# EAGLE design sensortag_motherboard_v004 (EAGLE 7.7.0)
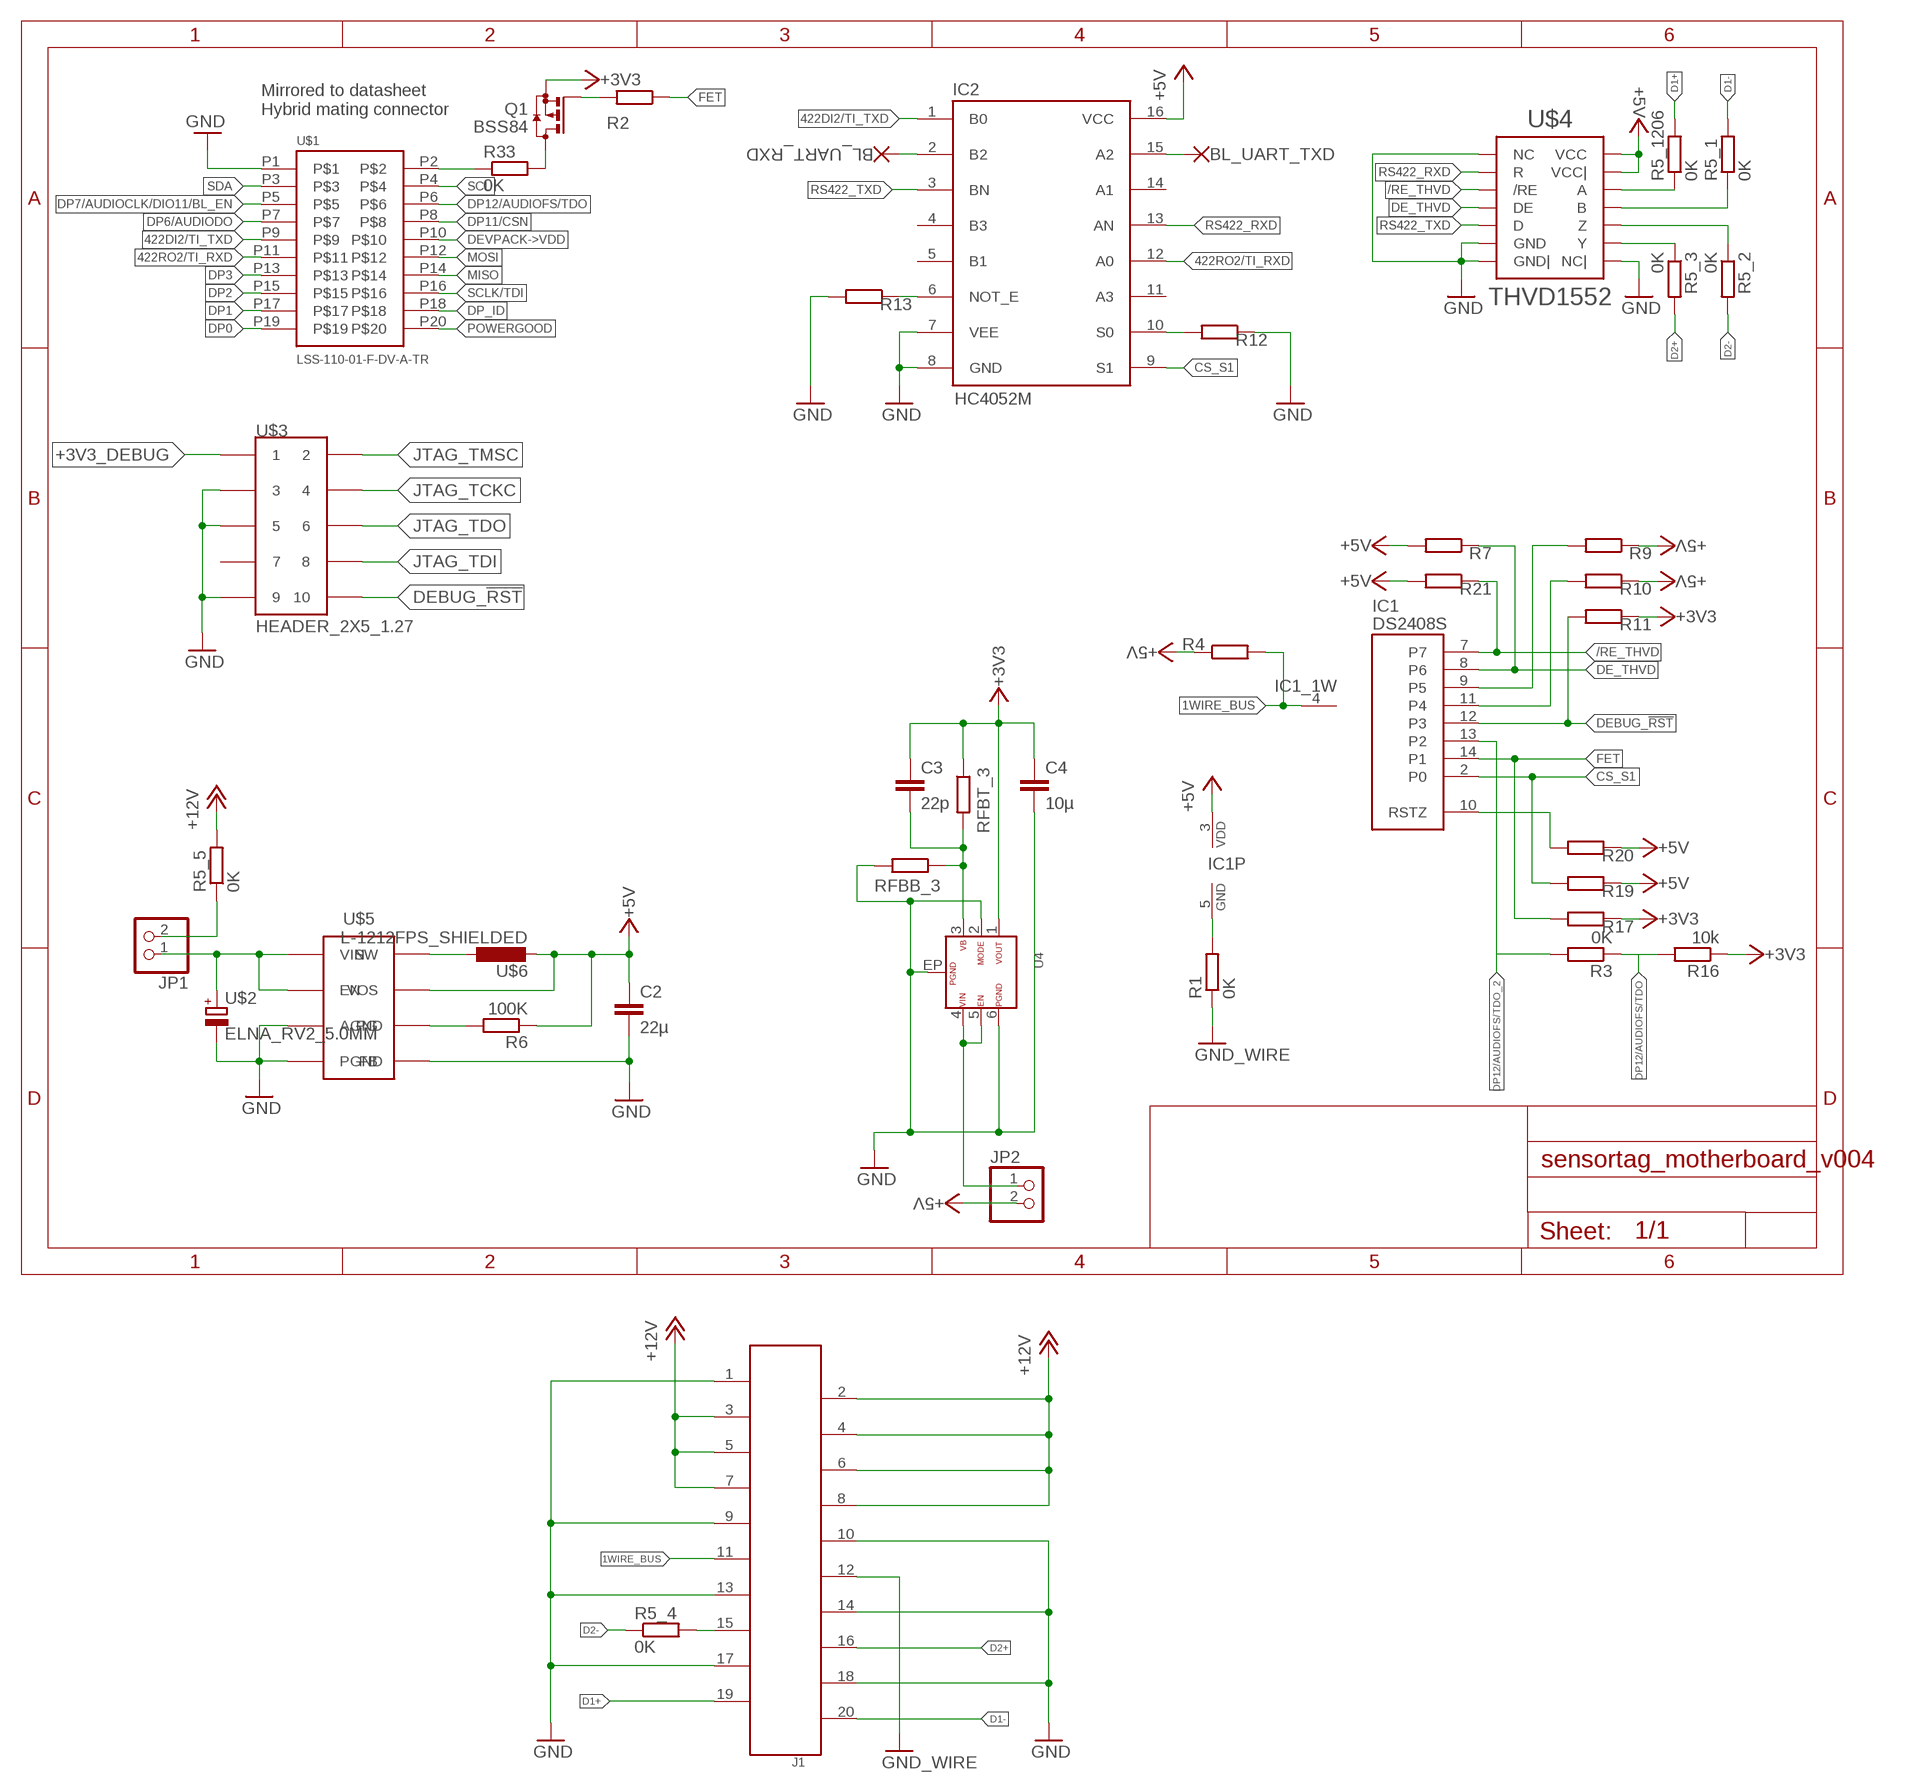
[diagram p0: schematic, sheet 1]

## Parts
BL_UART_RXD  WIREPADSMD1,27-254  [SMD1,27-2,54]
BL_UART_TXD  WIREPADSMD1,27-254  [SMD1,27-2,54]
C2  22µ  C-EUC1206  [C1206]
C3  22p  C-EUC0402  [C0402]
C4  10µ  C-EUC0603  [C0603]
IC1  DS2408S  [SO16]
IC2  HC4052M  [SO16]
J1  490107672012  [490107672012]
JP1  PINHD-1X2  [1X02]
JP2  PINHD-1X2  [1X02]
Q1  BSS84  [SOT23]
R1  0K  R-EU_R0603  [R0603]
R2  100  R0402  [R0402]
R3  0K  R-EU_R0603  [R0603]
R4  10k  R0402  [R0402]
R5_1  0K  R-EU_R1206  [R1206]
R5_2  0K  R-EU_R1206  [R1206]
R5_3  0K  R-EU_R1206  [R1206]
R5_4  0K  R-EU_R1206  [R1206]
R5_5  0K  R-EU_R1206  [R1206]
R5_1206  0K  R-EU_R1206  [R1206]
R6  100K  R-EU_R0603  [R0603]
R7  10k  R0402  [R0402]
R9  10k  R0402  [R0402]
R10  10k  R0402  [R0402]
R11  10k  R0402  [R0402]
R12  10k  R0402  [R0402]
R13  10k  R0402  [R0402]
R16  10k  R0402  [R0402]
R17  10k  R0402  [R0402]
R19  10k  R0402  [R0402]
R20  10k  R0402  [R0402]
R21  10k  R0402  [R0402]
R33  0K  R-EU_R0603  [R0603]
RFBB_3  22,1K  R0402  [R0402]
RFBT_3  100K  R0402  [R0402]
U4  VDMM_171960501  [VDMM_171960501]
U$1  LSS-110-01-F-DV-A-TR  [LSS-110-01-F-DV-A-TR]
U$2  ELNA_RV2_5.0MM  [ELNA_RV2_5.0MM]
U$3  HEADER_2X5_1.27  [HEADER_2X5_1.27]
U$4  TVHD1552  [SO14]
U$5  TPS62173  [WSON8]
U$6  L-1212FPS_SHIELDED  [L-1212FPS_SHIELDED]

## Nets
1WIRE_BUS: IC1.4(1W) J1.11 R4.P$2
422DI2/TI_TXD: IC2.1(B0) U$1.P9
422RO2/TI_RXD: IC2.12(A0) U$1.P11
+3V3: C3.1 C4.1 Q1.2(S) R11.P$1 R16.P$1 R17.P$1 RFBT_3.P$1 U4.1(VOUT)
+3V3_DEBUG: U$3.P$1
+5V: C2.1 IC1.3(VDD) IC2.16(VCC) JP2.2 R4.P$1 R6.1 R7.P$2 R9.P$1 R10.P$1 R19.P$1 R20.P$1 R21.P$2 U$4.13(VCC|) U$4.14(VCC) U$5.VOS U$6.P$2
+5V_JP: JP2.1 U4.4(VIN) U4.5(EN)
+12V: J1.2 J1.3 J1.4 J1.5 J1.6 J1.7 J1.8 R5_5.2
+12V_JP: JP1.1 U$2.P+(+) U$5.EN U$5.VIN
/RE_THVD: IC1.7 R21.P$1 U$4.3(/RE)
BL_UART_RXD: BL_UART_RXD.1(P) IC2.2(B2)
BL_UART_TXD: BL_UART_TXD.1(P) IC2.15(A2)
CS_S1: IC1.2(P0) IC2.9(S1) R19.P$2
D1+: J1.19 R5_1206.2
D1-: J1.20 R5_1.2
D2+: J1.16 R5_3.2
D2-: R5_2.2 R5_4.1
DE_THVD: IC1.8(P6) R7.P$1 U$4.4(DE)
DEBUG_!RST: IC1.12(P3) R11.P$2 U$3.P$10
DEVPACK->VDD: U$1.P10
DP0: U$1.P19
DP1: U$1.P17
DP2: U$1.P15
DP3: U$1.P13
DP6/AUDIODO: U$1.P7
DP7/AUDIOCLK/DIO11/BL_EN: U$1.P5
DP11/CSN: U$1.P8
DP12/AUDIOFS/TDO: R3.1 R16.P$2 U$1.P6
DP12/AUDIOFS/TDO_2: IC1.13(P2) R3.2
DP_ID: U$1.P18
DS4: IC1.11(P4) R10.P$2
DS5: IC1.9(P5) R9.P$2
DS_RESET: IC1.10(RSTZ) R20.P$2
FET: IC1.14(P1) R2.P$1 R17.P$2
GND: C2.2 C4.2 IC2.7(VEE) IC2.8(GND) J1.1 J1.9 J1.10 J1.13 J1.14 J1.17 J1.18 R12.P$1 R13.P$2 RFBB_3.P$2 U4.2(MODE) U4.6(PGND) U4.EP(PGND1) U$1.P1 U$2.P-(-) U$3.P$3 U$3.P$5 U$3.P$9 U$4.1(NC) U$4.6(GND) U$4.7(GND|) U$4.8(NC|) U$5.AGND U$5.AGND2(AGND) U$5.FB U$5.PGND
GND_WIRE: J1.12 R1.1
JTAG_TCKC: U$3.P$4
JTAG_TDI: U$3.P$8
JTAG_TDO: U$3.P$6
JTAG_TMSC: U$3.P$2
MISO: U$1.P14
MOSI: U$1.P12
N$2: R33.1 U$1.P2
N$3: Q1.3(D) R33.2
N$4: Q1.1(G) R2.P$2
N$5: R6.2 U$5.PG
N$6: C3.2 RFBB_3.P$1 RFBT_3.P$2 U4.3(FB)
N$7: R5_1206.1 U$4.12(A)
N$8: R5_1.1 U$4.11(B)
N$9: R5_2.1 U$4.10(Z)
N$10: R5_3.1 U$4.9(Y)
N$11: IC1.5(GND) R1.2
N$12: U$5.SW U$6.P$1
N$13: J1.15 R5_4.2
N$14: JP1.2 R5_5.1
N$22: IC2.10(S0) R12.P$2
POWERGOOD: U$1.P20
PULLDOWN_???: IC2.6(NOT_E) R13.P$1
RS422_RXD: IC2.13(AN) U$4.2(R)
RS422_TXD: IC2.3(BN) U$4.5(D)
SCL: U$1.P4
SCLK/TDI: U$1.P16
SDA: U$1.P3
Unconnected: IC2.4(B3) IC2.5(B1) IC2.11(A3) IC2.14(A1) U$3.P$7

## Notes on the sheet
- Mirrored to datasheet
  Hybrid mating connector

## Library data of the parts
BL_UART_RXD BL_UART_TXD = wirepad:WIREPAD: Wire PAD connect wire on PCB
C2-C4 = rcl:C-EU: CAPACITOR, European symbol
IC1 = 1wire:DS2408: 8-Channel Addressable Switch This is a general purpose I/O multiplier. The PIO pins P0..P7 are inputs/open drain outputs and can be used in a mixed I/O fashion. Output sink capability is appr. 4mA. Each input state can be read but changing input signals additionally trigger the egde detector for this input. The edge detector state can be read back, too. The RSTZ pin can be configured by software as a –STROBE output (default) or as the common edge detector –RESET input. In the latter mode, the output pins are all set to floating on a –RESET trigger, too. Author: Jan Kandziora <jjj@gmx.de>
IC2 = 40xx:HC4052M
J1 = customLibs:490107672012: REDFIT IDC SKEDD Connector WR-WST PROPERTIES: Insulator Material LCP Insulator Flammability Rating UL94 V-0 Insulator Color Black Contact Material CuNiSi Contact Plating Au (SKEDD), Sn (IDC) Cable AWG 28/1.27 mm ribbon cable Operating Temperature -25 °C up to +105 °C Compliance Lead free / RoHS Mating Cycle 10 Mating Cycle 25 PCB Thickness 1.6 mm ELECTRICAL PROPERTIES: Rated Current [1] 1 A Insulation Resistance 1000 MΩ Withstanding Voltage 500 V (AC) Contact Resistance 10 mΩ PACKAGING PROPERTIES: Packaging Tube <http://katalog.we-online.de/media/images/v2/Family_WR-WST_69010767xxxx.jpg> http://katalog.we-online.de/en/em/REDFIT_IDC_SKEDD Created 2017-11-16, Yingchun,Shan 2017 (C) Würth Elektronik
JP1 JP2 = pinhead:PINHD-1X2: PIN HEADER
Q1 = transistor-small-signal:BSS84: P-CHANNEL MOS FET
R1 R3 R5_1-R5_5 R5_1206 R6 R33 = rcl:R-EU_: RESISTOR, European symbol
R2 R4 R7 R9-R13 R16 R17 R19-R21 RFBB_3 RFBT_3 = iml_rcl:R0402
U4 = Eagle_STEP-DOWN-CONVERTER (rev18c):VDMM_171960501: MagI³C-VDMM Variable Step Down MicroModule Characteristics LGA <http://katalog.we-online.de/media/images/v2/LGA-6_MicroModule_171960501.jpg> Details see: http://katalog.we-online.de/pm/datasheet/171960501.pdf Created By Yingchun,Shan 2017-12-15 2017 (C) Wurth Elektronik
U$1 = customLibs:LSS-110-01-F-DV-A-TR
U$2 = customLibs:ELNA_RV2_5.0MM
U$3 = David_Spezial:HEADER_2X5_1.27
U$4 = moekoe:TVHD1552
U$5 = customLibs:TPS62173
U$6 = customLibs:L-1212FPS_SHIELDED

## Board
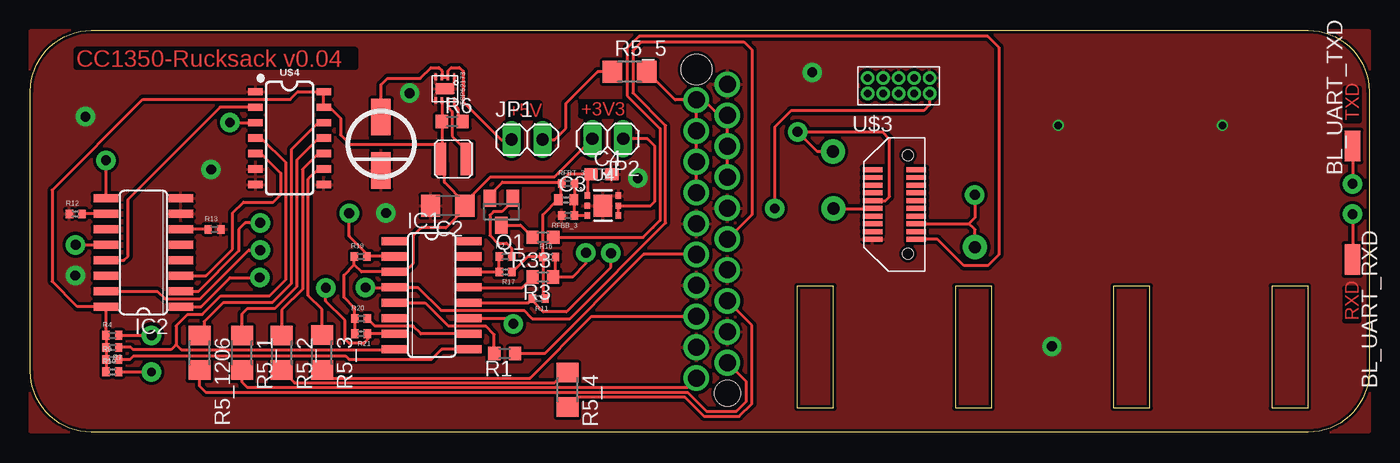
[diagram p1: board, top side]
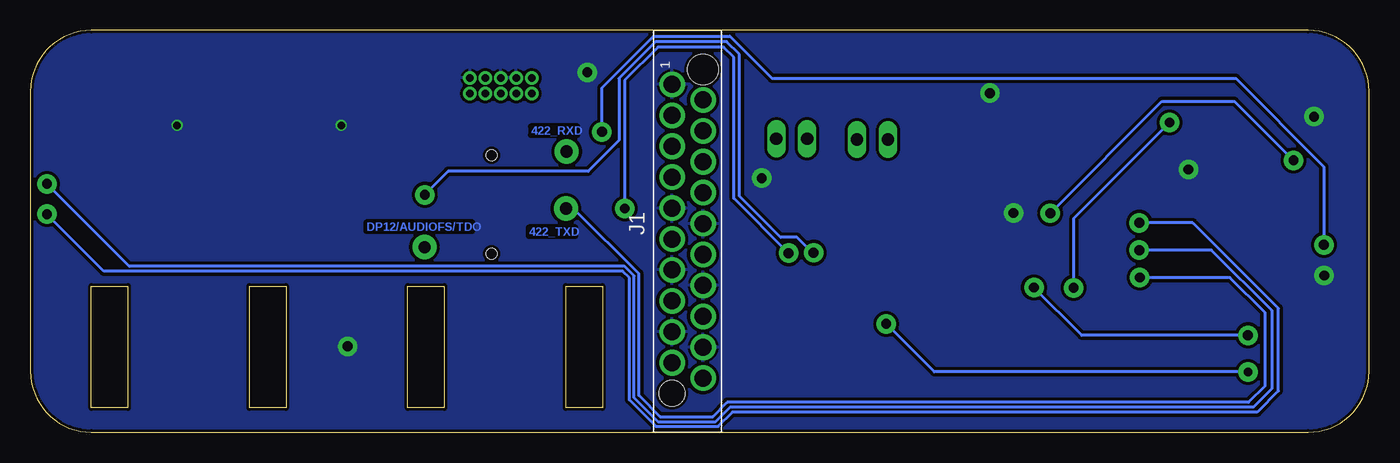
[diagram p2: board, bottom side, seen from below]

Size 110 x 33 mm. Coordinates in mm from the lower left corner, seen from the top.
Outline: 105,0 5,0 arc-90 0,5 0,28 arc-90 5,33 105,33 arc-90 110,28 110,5 arc-90 105,0
Outline: 63,12 63,2 66,2 66,12 63,12
Outline: 102,12 102,2 105,2 105,12 102,12
Outline: 76,12 76,2 79,2 79,12 76,12
Outline: 89,12 89,2 92,2 92,12 89,12
Copper layers (1*16): Top 0.018mm / dielectric 1.55mm / Bottom 0.018mm
Design rules "Multi-CB_2L_125um-Tracks_OL35um *": minimum track width 0.125mm, minimum drill 0.2mm, track to track 0.125mm, track to pad 0.125mm, pad to pad 0.125mm, via to via 0.125mm, smd to smd 0mil, copper to edge 0.2mm, drill to drill 0.2mm, minimum pad ring 0.125mm, minimum via ring 0.125mm, stop-mask expansion 2mil, vias tented up to drill 0.45mm, thermal gap 0.2mm

### Footprints (pad centres in the part's own frame; a part is rotated, then mirrored left to right if it is on the bottom)
SMD1,27-2,54 = smd 1.27 x 2.54: 1 0,0
C1206 = smd 1.6 x 1.8: 1 -1.4,0; 2 1.4,0
C0402 = smd 0.7 x 0.9: 1 -0.65,0; 2 0.65,0
C0603 = smd 1.1 x 1: 1 -0.85,0; 2 0.85,0
SO16 = smd 0.66 x 2.032: 1 -4.445,-3.073; 2 -3.175,-3.073; 3 -1.905,-3.073; 4 -0.635,-3.073; 5 0.635,-3.073; 6 1.905,-3.073; 7 3.175,-3.073; 8 4.445,-3.073; 9 4.445,3.073; 10 3.175,3.073; 11 1.905,3.073; 12 0.635,3.073; 13 -0.635,3.073; 14 -1.905,3.073; 15 -3.175,3.073; 16 -4.445,3.073
490107672012 = drill 1.4 pad 1.42: 1 12.065,1.27; 2 10.795,-1.27; 3 9.525,1.27; 4 8.255,-1.27; 5 6.985,1.27; 6 5.715,-1.27; 7 4.445,1.27; 8 3.175,-1.27; 9 1.905,1.27; 10 0.635,-1.27; 11 -0.635,1.27; 12 -1.905,-1.27; 13 -3.175,1.27; 14 -4.445,-1.27; 15 -5.715,1.27; 16 -6.985,-1.27; 17 -8.255,1.27; 18 -9.525,-1.27; 19 -10.795,1.27; 20 -12.065,-1.27 | hole 2.1: -13.295,1.27 | hole 2.5: 13.295,-1.27
1X02 = drill 1.016 long: 1 -1.27,0; 2 1.27,0
SOT23 = smd 1 x 1.4: 1 -0.95,-1.1; 2 0.95,-1.1; 3 0,1.1
R0603 = smd 1 x 1.1: 1 -0.85,0; 2 0.85,0
R0402 = smd 0.61 x 0.711: P$1 -0.52,0; P$2 0.52,0
R1206 = smd 1.6 x 1.803: 1 -1.422,0; 2 1.422,0
VDMM_171960501 = smd 0.45 x 0.55: 1 -1.275,0.825; 3 -1.275,-0.825; 4 1.275,-0.825; 6 1.275,0.825 | smd 0.45 x 0.5: 2 -1.275,0; 5 1.275,0 | smd 1.5 x 1.8: EP 0,0
LSS-110-01-F-DV-A-TR = smd 0.4 x 1.6: P1 2.857,-1.8; P2 2.857,1.8; P3 2.223,-1.8; P4 2.223,1.8; P5 1.587,-1.8; P6 1.587,1.8; P7 0.953,-1.8; P8 0.953,1.8; P9 0.318,-1.8; P10 0.318,1.8; P11 -0.318,-1.8; P12 -0.318,1.8; P13 -0.953,-1.8; P14 -0.953,1.8; P15 -1.587,-1.8; P16 -1.587,1.8; P17 -2.223,-1.8; P18 -2.223,1.8; P19 -2.857,-1.8; P20 -2.857,1.8 | hole 0.89: 4.04,1.1; -4.04,1.1
ELNA_RV2_5.0MM = smd 1.6 x 3: P+ 0,2.2; P- 0,-2.2
HEADER_2X5_1.27 = drill 0.6 pad 1.1: P$1 -2.54,0.635; P$2 -2.54,-0.635; P$3 -1.27,0.635; P$4 -1.27,-0.635; P$5 0,0.635; P$6 0,-0.635; P$7 1.27,0.635; P$8 1.27,-0.635; P$9 2.54,0.635; P$10 2.54,-0.635
SO14 = smd 0.6 x 1.2: 1 -3.175,-2.8; 2 -1.905,-2.8; 3 -0.635,-2.8; 4 0.635,-2.8; 5 1.905,-2.8; 6 3.175,-2.8; 7 4.445,-2.8; 8 4.445,2.8; 9 3.175,2.8; 10 1.905,2.8; 11 0.635,2.8; 12 -0.635,2.8; 13 -1.905,2.8; 14 -3.175,2.8
WSON8 = smd 0.5 x 0.25: AGND -0.95,-0.75; EN -0.95,-0.25; FB 0.95,-0.75; PG 0.95,0.75; PGND -0.95,0.75; SW 0.95,0.25; VIN -0.95,0.25; VOS 0.95,-0.25 | smd 0.9 x 1.6: AGND2 0,0
L-1212FPS_SHIELDED = smd 1 x 2.7: P$1 1.1,0; P$2 -1.1,0

### Placement (x,y rotation side)
BL_UART_RXD  108.63,14.19 180 top
BL_UART_TXD  108.64,23.51 0 top
C2  34.28,18.59 180 top
C3  44.02,19.08 0 top
C4  46.92,21.19 0 top
IC1  32.97,11.26 270 top
IC2  9.29,14.76 90 top
J1  56,16.5 90 bottom
JP1  40.81,24.03 0 top
JP2  47.44,24.1 180 top
Q1  38.69,18.11 180 top
R1  38.96,6.46 180 top
R2  39.03,14.42 0 top
R3  42.11,12.74 180 top
R4  6.73,7.96 0 top
R5_1  17.39,6.52 270 top
R5_2  20.66,6.52 270 top
R5_3  23.95,6.54 270 top
R5_4  44.14,3.47 270 top
R5_5  49.24,29.6 0 top
R5_1206  13.9,6.52 270 top
R6  34.66,25.52 0 top
R7  6.73,6.96 180 top
R9  6.73,5.96 0 top
R10  6.73,4.96 0 top
R11  41.77,10.97 180 top
R12  3.71,17.93 0 top
R13  15.13,16.66 0 top
R16  42.63,14.4 0 top
R17  39.04,13.16 180 top
R19  27.14,14.44 0 top
R20  27.18,9.33 0 top
R21  27.17,8.08 180 top
R33  42.12,16.01 180 top
RFBB_3  44.18,17.79 180 top
RFBT_3  44.17,20.43 0 top
U4  47.04,18.61 0 top
U$1  71,18.7 270 top
U$2  28.81,23.68 0 top
U$3  71.35,28.46 0 top
U$4  21.3,24.79 270 top
U$5  34.06,28.21 270 top
U$6  34.76,22.43 0 top

### Tracks (layer width: path | path; a pad name or v marks a point on that pad's centre or on a via)
1WIRE_BUS  (via drill 0.8 pad 1.6)
  Top 0.254: R4.P$2 v9.96,7.96 | v27.54,11.88 IC1.4 31.83,11.89 33.73,9.99 40.56,9.99 41.22,9.33 44.33,9.33 52.19,17.19 52.19,25.17 49.5,27.87 49.5,31.34 50.22,32.06 58.63,32.06 59.27,31.42 59.27,17.87 J1.11
  Bottom 0.254: v9.96,7.96 23.62,7.96 v27.54,11.88
422DI2/TI_TXD  (via drill 0.8 pad 1.6, 1 pad 2)
  Top 0.254: IC2.1 14.02,10.31 16.41,12.7 v18.84,12.7 | v65.99,18.37 U$1.P9
  Bottom 0.254: v18.84,12.7 11.42,12.7 8.56,9.83 8.56,3.78 9.9,2.44 52.75,2.44 53.91,1.28 58.26,1.28 60,3.02 60,13 65.37,18.37 v65.99,18.37
422RO2/TI_RXD  (via drill 0.8 pad 1.6, 1 pad 2)
  Top 0.254: v3.71,15.39 IC2.12 | U$1.P11 70.27,19.02 70.6,19.34 70.6,24.07 70,24.67 v63.03,24.67 64.64,23.06 v65.94,23.06
  Bottom 0.254: v3.71,15.39 v3.71,15.4 3.71,21.8 10.97,29.06 49.06,29.06 52.53,32.53 58.78,32.53 63.03,28.28 v63.03,24.67
+3V3
  Top 0.254: R17.P$1 39.57,13.14 39.57,13.15 | 37.83,19.21 Q1.2 | 39.69,13.16 R17.P$1 | R16.P$1 40.84,14.4 39.6,13.16 R17.P$1 | R16.P$1 42.11,11.15 R11.P$1 | 37.74,19.32 Q1.2 | 37.46,19.5 Q1.2 | Q1.2 37.74,19.48 38.8,20.53 43.55,20.53 RFBT_3.P$1 | U4.1 45.76,20.88 C4.1 44.2,21.19 43.66,20.64 RFBT_3.P$1 | R16.P$1 42.11,17.88 43.32,19.08 C3.1 43.59,19.31 43.59,20.37 RFBT_3.P$1 | RFBT_3.P$1 43.61,20.43
+5V
  Top 0.254: R10.P$1 R9.P$1 R7.P$2 R4.P$1 IC2.16 3.87,10.31 1.78,12.4 1.78,19.89 9.23,27.34 21.35,27.34 21.97,27.96 U$4.14 U$4.13 24.57,26.69 25.48,25.79 25.48,24.43 26.25,23.66 33.28,23.66 33.28,23.54 33.81,23 | R21.P$2 R20.P$1 26.66,10.19 25.78,11.07 25.78,12.9 26.62,13.74 | 26.62,13.74 27.2,13.16 IC1.3 30.74,13.16 31.48,13.9 31.48,16.16 32.1,16.79 34.14,16.79 35.68,18.33 C2.1 35.68,18.85 | 26.62,13.74 R19.P$1 | JP2.2 43.03,20.96 37.79,20.96 35.68,18.85 | 35.68,18.85 35.68,18.86 | U$5.VOS R6.1 33.81,23 | 33.81,23 33.81,22.59 U$6.P$2 34.03,22.06 34.03,20.52 35.68,18.86 | 35.68,18.86
+5V_JP
  Top 0.254: U4.4 U4.5 50.96,18.61 51.32,18.97 51.32,23.49 50.71,24.1 JP2.1
+12V
  Top 0.254: J1.8 J1.6 J1.4 J1.2 | J1.7 J1.5 J1.3 56.57,26.02 55.3,27.3 J1.2 | J1.2 52.97,27.3 R5_5.2
+12V_JP
  Top 0.254: JP1.1 38.66,24.03 35.56,27.13 35.56,29.65 35.26,29.95 34.57,29.95 34.31,29.69 U$5.VIN U$5.EN 33.81,29.69 33.56,29.94 32.91,29.94 32.04,29.07 29.34,29.07 28.81,28.54 U$2.P+
/RE_THVD  (via drill 0.8 pad 1.6)
  Top 0.254: IC1.7 R21.P$1 | R21.P$1 | R21.P$1 27.7,7.62 27.36,7.29 26.2,7.29 25.86,7.63 25.86,9.17 24.27,10.76 v24.27,11.86 | v16.39,25.43 U$4.3
  Bottom 0.254: v16.39,25.43 24.27,17.55 v24.27,11.86
BL_UART_RXD  (via drill 0.8 pad 1.6)
  Top 0.254: IC2.2 13.83,11.58 17.13,14.88 17.13,16.67 17.66,17.2 v18.88,17.2 | v108.65,17.91 108.65,14.2 BL_UART_RXD.1
  Bottom 0.254: v108.65,17.91 103.96,13.22 61.33,13.22 60.79,12.68 60.79,2.66 58.6,0.48 53.49,0.48 52.32,1.65 9.19,1.65 7.46,3.39 7.46,10.16 14.49,17.2 v18.88,17.2
BL_UART_TXD  (via drill 0.8 pad 1.6)
  Top 0.254: IC2.15 10.43,11.57 11.06,10.94 13.94,10.94 17.95,14.95 v18.88,14.95 | BL_UART_TXD.1 v108.64,20.4 v108.65,20.4
  Top 0.406: IC2.15
  Bottom 0.254: v108.65,20.4 101.88,13.63 61.17,13.63 60.39,12.84 60.39,2.83 58.43,0.87 53.69,0.87 52.5,2.06 9.5,2.06 8,3.56 8,10 12.95,14.95 v18.88,14.95
CS_S1  (via drill 0.8 pad 1.6)
  Top 0.254: IC1.2 29.88,14.44 R19.P$2 27.64,14.46 27.64,14.67 26.2,16.11 v26.2,17.98 | IC2.9 v6.22,22.33
  Bottom 0.254: v6.22,22.33 11.05,27.16 17.02,27.16 v26.2,17.98
D1+
  Top 0.254: R5_1206.2 13.9,3.77 14.4,3.27 54,3.27 55.54,1.73 58.01,1.73 58.82,2.54 58.82,4.15 J1.19
D1-
  Top 0.254: R5_1.2 17.39,4.11 17.83,3.66 53.95,3.66 J1.20
D2+
  Top 0.254: R5_3.2 24.63,4.45 41.04,4.45 46.11,9.52 J1.16
D2-
  Top 0.254: R5_2.2 21.7,4.05 43.05,4.05 44,5 44.03,5 R5_4.1
DE_THVD
  Top 0.254: 29.75,6.96 IC1.8 29.86,6.77 12.39,6.77 11.98,7.19 | U$4.4 18.97,24.15 21,22.13 21,12.55 19.65,11.2 15.64,11.2 14.13,9.68 12.92,9.68 11.98,8.74 11.98,7.19 | R7.P$1 8.24,6.96 8.43,6.77 11.56,6.77 11.98,7.19
DEBUG_!RST  (via drill 0.8 pad 1.6)
  Top 0.254: v47.7,14.7 47.7,13.55 44.04,9.89 42.14,9.89 41.25,10.78 R11.P$2 40.9,10.62 IC1.12 | U$3.P$10 73.89,26.89 73.41,26.41 62.5,26.41 61.17,25.08 v61.17,18.37
  Bottom 0.254: v47.7,14.7 52.2,19.2 52.2,30.78 53.05,31.63 58.43,31.63 61.17,28.9 v61.17,18.37
DP12/AUDIOFS/TDO  (via drill 0.8 pad 1.6, 1 pad 2)
  Top 0.254: v77.6,19.5 77.6,17.6 77.13,17.13 | v45.65,14.74 45.65,13.86 44.53,12.74 R3.1 43.15,12.94 R16.P$2 | U$1.P6 77.11,17.11 77.13,17.13 | v77.61,15.2 77.61,16.65 77.13,17.13
  Bottom 0.254: v77.6,19.5 75.67,21.43 64.18,21.43 61.64,23.96 61.64,29.07 58.62,32.09 52.79,32.09 51.74,31.04 51.74,19.38 48.36,16 47,16 45.74,14.74 v45.65,14.74
DP12/AUDIOFS/TDO_2
  Top 0.254: IC1.13 40.4,11.88 R3.2
DS4  (via drill 0.7 pad 1.6, 0.8 pad 1.6)
  Top 0.254: R10.P$2 v9.94,4.96 | IC1.11 39.22,9.36 v39.67,8.9
  Bottom 0.254: v9.94,4.96 35.73,4.96 v39.67,8.9
DS5
  Top 0.254: 36.1,6.76 IC1.9 33.79,6.81 32.96,5.98 26.18,5.98 25.89,6.27 8.48,6.27 8.17,5.96 R9.P$2 7.3,6
DS_RESET
  Top 0.254: IC1.10 32.09,8.08 31.45,8.71 28.31,8.71 R20.P$2
FET
  Top 0.254: IC1.14 R17.P$2 R2.P$1
GND  (via drill 0.6, 0.8 pad 1.6)
  Top 0.254: U$5.PGND 34.81,28.67 34.35,28.21 U$5.AGND2
  other vias: 4.53,25.91 31.16,27.84 3.68,12.86 83.94,7.05 14.84,21.58 49.91,20.87 84.45,25.2 97.95,25.2 64.25,29.56 29.22,18.01
  pour Top (isolate 0.254): 0,33 110,33 110,0 0,0
  pour Bottom (isolate 0.254): 0,33 110,33 110,0 0,0
GND_WIRE
  Top 0.254: J1.12 50.39,14.6 42.25,6.46 R1.1
N$2
  Top 0.254: R33.1 50.35,16 51.18,16.82 51.74,17.39 51.75,17.39 51.75,24.93 49.04,27.64 49.04,31.54 50.02,32.52 78.66,32.52 79.58,31.6 79.58,14.58 78.68,13.68 76.71,13.68 74.54,15.84 U$1.P2
N$3
  Top 0.254: Q1.3 40.26,17.02 R33.2
N$4
  Top 0.254: Q1.1 39.65,19.02 38.74,18.12 38.05,18.12 37.77,17.83 37.77,16.17 38.4,15.54 39.12,15.54 39.55,15.1 R2.P$2
N$5
  Top 0.254: U$5.PG 34.81,26.87 35.13,26.55 35.13,25.9 R6.2
N$6
  Top 0.254: U4.3 RFBB_3.P$1 | RFBB_3.P$1 | RFBT_3.P$2 44.7,19.11 C3.2 44.7,19.05 RFBB_3.P$1
N$7
  Top 0.254: R5_1206.1 14.27,8.31 14.27,9.07 15.87,10.67 19.9,10.67 21.45,12.22 21.45,23.24 23.63,25.42 U$4.12
N$8
  Top 0.254: R5_1.1 17.39,9.71 17.84,10.17 20.1,10.17 21.89,11.96 21.89,22.35 23.69,24.15 U$4.11
N$9
  Top 0.254: R5_2.1 20.66,10.05 22.35,11.74 22.35,21.59 23.65,22.88 U$4.10
N$10
  Top 0.254: R5_3.1 23.95,10.1 22.82,11.23 22.82,20.8 23.63,21.61 U$4.9
N$11
  Top 0.254: IC1.5 32.42,10.62 34.32,8.72 37.4,8.72 38.12,8.01 R1.2
N$12
  Top 0.254: U$5.SW 34.31,26.68 34.66,26.33 34.66,24.32 35.86,23.13 U$6.P$1
N$13
  Top 0.254: J1.15 59.28,8.78 59.28,2.33 58.24,1.29 55.37,1.29 53.79,2.87 44.95,2.87 R5_4.2
N$14
  Top 0.254: R5_5.1 46.6,29.6 44.01,27.01 44.01,24.98 43.06,24.03 JP1.2
N$22
  Top 0.254: IC2.10 4.24,17.94 R12.P$2
  Top 0.406: IC2.10
PULLDOWN_???
  Top 0.254: R13.P$1 IC2.6
RS422_RXD
  Top 0.254: U$4.2 15.58,26.69 8.02,19.13 8.02,14.47 7.67,14.12 IC2.13
RS422_TXD
  Top 0.254: U$4.5 18.98,22.88 20.57,21.29 20.57,19.52 19.95,18.9 17.51,18.9 16.62,18.01 16.62,15.03 14.44,12.85 IC2.3

### Text on the board
Top: CC1350-Rucksack v0.04 | +5V | +3V3 | TXD | RXD
Bottom: 422_RXD | DP12/AUDIOFS/TDO | 422_TXD